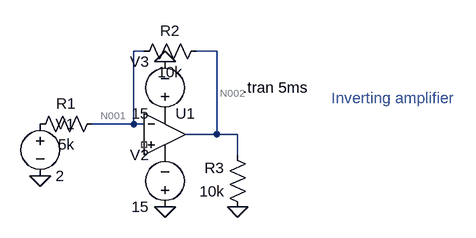
[diagram p0: schematic inverting amplifier.asc]
inverting amplifier.asc, the LTspice schematic file:
Version 4
SHEET 1 880 680
WIRE 176 48 160 48
WIRE 288 48 256 48
WIRE 160 160 160 48
WIRE 160 160 96 160
WIRE 176 160 160 160
WIRE 288 176 288 48
WIRE 288 176 240 176
WIRE 320 176 288 176
WIRE 320 208 320 176
FLAG 208 64 0
FLAG 208 288 0
FLAG 16 240 0
FLAG 320 288 0
SYMBOL Opamps\\UniversalOpamp2 208 176 R0
SYMATTR InstName U1
SYMBOL res 112 144 R90
WINDOW 0 0 56 VBottom 2
WINDOW 3 32 56 VTop 2
SYMATTR InstName R1
SYMATTR Value 5k
SYMBOL res 272 32 R90
WINDOW 0 0 56 VBottom 2
WINDOW 3 32 56 VTop 2
SYMATTR InstName R2
SYMATTR Value 10k
SYMBOL res 336 304 R180
WINDOW 0 36 76 Left 2
WINDOW 3 36 40 Left 2
SYMATTR InstName R3
SYMATTR Value 10k
SYMBOL voltage 16 144 R0
WINDOW 123 0 0 Left 0
WINDOW 39 0 0 Left 0
SYMATTR InstName V1
SYMATTR Value 2
SYMBOL voltage 208 304 R180
WINDOW 0 24 96 Left 2
WINDOW 3 24 16 Left 2
WINDOW 123 0 0 Left 0
WINDOW 39 0 0 Left 0
SYMATTR InstName V2
SYMATTR Value 15
SYMBOL voltage 208 160 R180
WINDOW 0 24 96 Left 2
WINDOW 3 24 16 Left 2
WINDOW 123 0 0 Left 0
WINDOW 39 0 0 Left 0
SYMATTR InstName V3
SYMATTR Value 15
TEXT 328 104 Left 2 !.tran 5ms
TEXT 464 120 Left 2 ;Inverting amplifier

The netlist it stands for:
* inverting amplifier.asc
XU1 NC_01 N001 P001 P002 N002 level.2 Avol=1Meg GBW=10Meg Slew=10Meg ilimit=25m rail=0 Vos=0 phimargin=45 en=0 enk=0 in=0 ink=0 Rin=500Meg  ; pins IN+ IN- V+ V- OUT
R1 N001 P003 5k
R2 N002 N001 10k
R3 0 N002 10k
V1 P003 0 2
V2 0 P002 15
V3 P001 0 15
.tran 5ms
* Inverting amplifier
.lib UniversalOpamps2.sub
.backanno
.end

* Results of the author's LTspice run, read from the files saved beside the schematic
* Operating Point, zero values left out:
*   V(n002) = -4 V
*   V(p001) = 15 V
*   V(p002) = -15 V
*   V(n001) = 4.013 µV
*   V(p003) = 2 V
*   I(R3) = 400 µA
*   I(R2) = -400 µA
*   I(R1) = -400 µA
*   I(V3) = -1.098 mA
*   I(V2) = -1.898 mA
*   I(V1) = -400 µA
*   Ix(u1:3) = 1.098 mA
*   Ix(u1:4) = -1.898 mA
*   Ix(u1:5) = 800 µA